# Altium schematic sheet 原理图.SchDoc
size A4
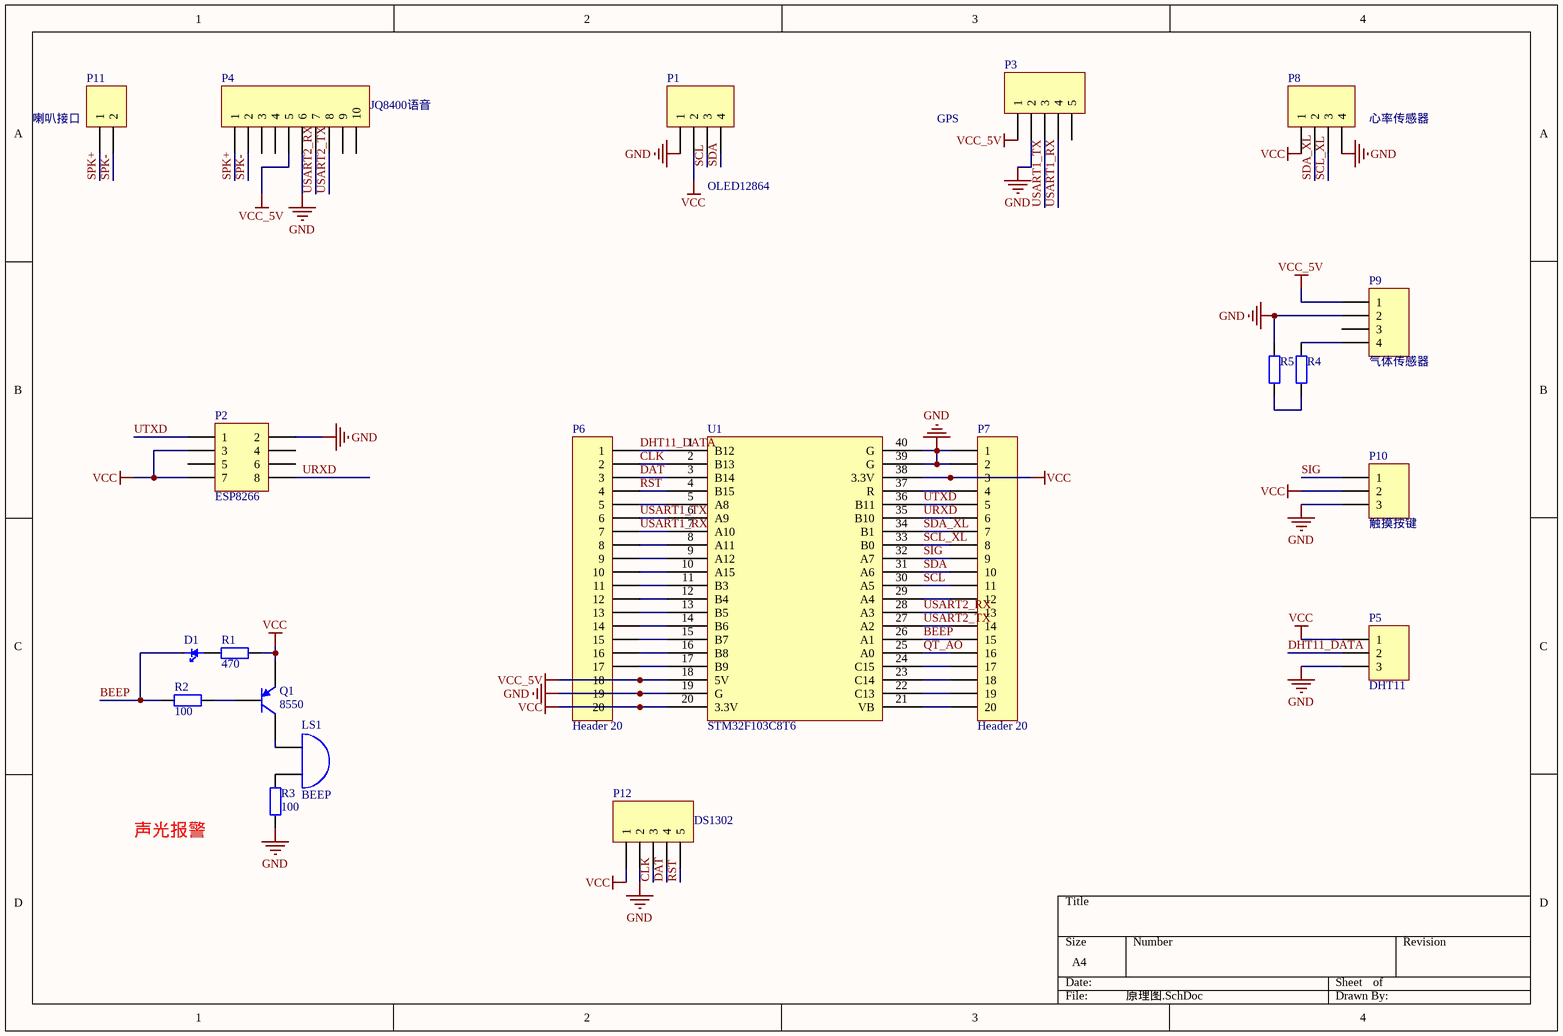
[diagram p0: 原理图.SchDoc]

## Parts
D1  W  [LC-0805_LED_S1]  (value not drawn)
LS1  BEEP  [HDR1X4]
P1  OLED12864  [HDR1X4]
P2  ESP8266  [HDR2X4]
P3  GPS  [HDR1X5]
P4  JQ8400语音  [HDR1X10]
P5  DHT11  [HDR1X3]
P6  Header 20  [HDR1X20]
P7  Header 20  [HDR1X20]
P8  心率传感器  [HDR1X4]
P9  气体传感器  [HDR1X4]
P10  触摸按键  [HDR1X3]
P11  喇叭接口  [HDR1X2]
P12  DS1302  [HDR1X5]
Q1  8550  [SOT-23 MOS]
R1  value 470  [0805]  (hidden comment: Res2)
R2  value 100  [0805]  (hidden comment: Res2)
R3  value 100  [0805]  (hidden comment: Res2)
R4  Res2  [0805]  (value not drawn)
R5  Res2  [0805]  (value not drawn)
U1  STM32F103C8T6  [STM32F103C8T6_HXB]

## Nets
GND: P1.1 P2.2 P3.2 P4.6 P5.3 P6.19 P7.1 P7.2 P8.4 P9.2 P10.3 P12.2 R3.1 R5.1 U1.19(G) U1.39(G) U1.40(G)
VCC: P1.2 P2.3 P2.7 P5.1 P6.20 P7.3 P8.1 P10.2 P12.1 Q1.1(E) R1.1 U1.20(3.3V) U1.38(3.3V)
VCC_5V: P3.1 P4.5 P6.18 P9.1 U1.18(5V)
BEEP: D1.K P7.15 R2.2 U1.26(A1)
CLK: P6.2 P12.3 U1.2(B13)
DAT: P6.3 P12.4 U1.3(B14)
DHT11_DATA: P5.2 P6.1 U1.1(B12)
QT_AO: P7.16 U1.25(A0)
RST: P6.4 P12.5 U1.4(B15)
SCL: P1.3 P7.11 U1.30(A5)
SCL_XL: P7.8 P8.3 U1.33(B0)
SDA: P1.4 P7.10 U1.31(A6)
SDA_XL: P7.7 P8.2 U1.34(B1)
SIG: P7.9 P10.1 U1.32(A7)
SPK+: P4.1 P11.1
SPK-: P4.2 P11.2
URXD: P2.8 P7.6 U1.35(B10)
USART1_RX: P3.4 P6.7 U1.7(A10)
USART1_TX: P3.3 P6.6 U1.6(A9)
USART2_RX: P4.7 P7.13 U1.28(A3)
USART2_TX: P4.8 P7.14 U1.27(A2)
UTXD: P2.1 P7.5 U1.36(B11)
NetD1_A: D1.A R1.2
NetLS1_1: LS1.1(A) Q1.3(C)
NetLS1_2: LS1.2(B) R3.2
NetP6_5: P6.5 U1.5(A8)
NetP6_8: P6.8 U1.8(A11)
NetP6_9: P6.9 U1.9(A12)
NetP6_10: P6.10 U1.10(A15)
NetP6_11: P6.11 U1.11(B3)
NetP6_12: P6.12 U1.12(B4)
NetP6_13: P6.13 U1.13(B5)
NetP6_14: P6.14 U1.14(B6)
NetP6_15: P6.15 U1.15(B7)
NetP6_16: P6.16 U1.16(B8)
NetP6_17: P6.17 U1.17(B9)
NetP7_4: P7.4 U1.37(R)
NetP7_12: P7.12 U1.29(A4)
NetP7_17: P7.17 U1.24(C15)
NetP7_18: P7.18 U1.23(C14)
NetP7_19: P7.19 U1.22(C13)
NetP7_20: P7.20 U1.21(VB)
NetP9_4: P9.4 R4.1
NetQ1_2: Q1.2(B) R2.1
NetR4_2: R4.2 R5.2

Not connected (* = marked no-connect by the designer): P2 4 5 6; P3 5; P4 3 4 9 10; P9 3

## Notes on the sheet
- 声光报警

## Library data of the parts
D1 = LED
LS1 = Bell: Electrical Bell; Published: 24-Mar-1999; LatestRevisionDate: 17-Jul-2002; LatestRevisionNote: Re-released for DXP Platform.; PackageReference: PIN2; Publisher: Altium Limited
P1 P8 P9 = Header 4: Header, 4-Pin; LatestRevisionDate: 17-Jul-2002; LatestRevisionNote: Re-released for DXP Platform.; Publisher: Altium Limited
P2 = Header 4X2: Header, 4-Pin, Dual row; LatestRevisionDate: 17-Jul-2002; LatestRevisionNote: Re-released for DXP Platform.; Publisher: Altium Limited
P3 P12 = Header 5: Header, 5-Pin; LatestRevisionDate: 17-Jul-2002; LatestRevisionNote: Re-released for DXP Platform.; Publisher: Altium Limited
P4 = Header 10: Header, 10-Pin; LatestRevisionDate: 17-Jul-2002; LatestRevisionNote: Re-released for DXP Platform.; Publisher: Altium Limited
P5 P10 = Header 3: Header, 3-Pin; LatestRevisionDate: 17-Jul-2002; LatestRevisionNote: Re-released for DXP Platform.; Publisher: Altium Limited
P6 P7 = Header 20: Header, 20-Pin; LatestRevisionDate: 17-Jul-2002; LatestRevisionNote: Re-released for DXP Platform.; Publisher: Altium Limited
P11 = Header 2: Header, 2-Pin; LatestRevisionDate: 17-Jul-2002; LatestRevisionNote: Re-released for DXP Platform.; Publisher: Altium Limited
Q1 = 2N3906: PNP General Purpose Amplifier; Published: 8-Jun-2000; LatestRevisionDate: 15-Jan-2003; LatestRevisionNote: PCB Footprint 'BCY-W3/D4.7' replaced; DatasheetVersion: 1997; PackageVersion: Sep-1998; PackageReference: TO-92A; Publisher: Altium Limited; PackageDescription: TO, Flat Index; 3 In-Line, Axial Leads; Body Dia. 4.5mm; Leads 0.51 x 0.48 mm (max); ComponentLink1Description: Manufacturer Link; ComponentLink1URL: http://www.fairchildsemi.com/; ComponentLink2Description: Datasheet; ComponentLink2URL: http://www.fairchildsemi.com/ds/2N%2F2N3906.pdf
R1-R3 = Res2: Resistor; Published: 8-Jun-2000; LatestRevisionDate: 17-Jul-2002; LatestRevisionNote: Re-released for DXP Platform.; PackageReference: AXIAL-0.4; Publisher: Altium Limited; PackageDescription: Axial Device, Thru-Hole; 2 Leads; 0.4 in Pin Spacing
R4 R5 = Res2: Resistor; Value: 1K; Published: 8-Jun-2000; LatestRevisionDate: 17-Jul-2002; LatestRevisionNote: Re-released for DXP Platform.; PackageReference: AXIAL-0.4; Publisher: Altium Limited; PackageDescription: Axial Device, Thru-Hole; 2 Leads; 0.4 in Pin Spacing
U1 = Component_1